# Altium schematic sheet GPRS_GNSS.SchDoc
size A3
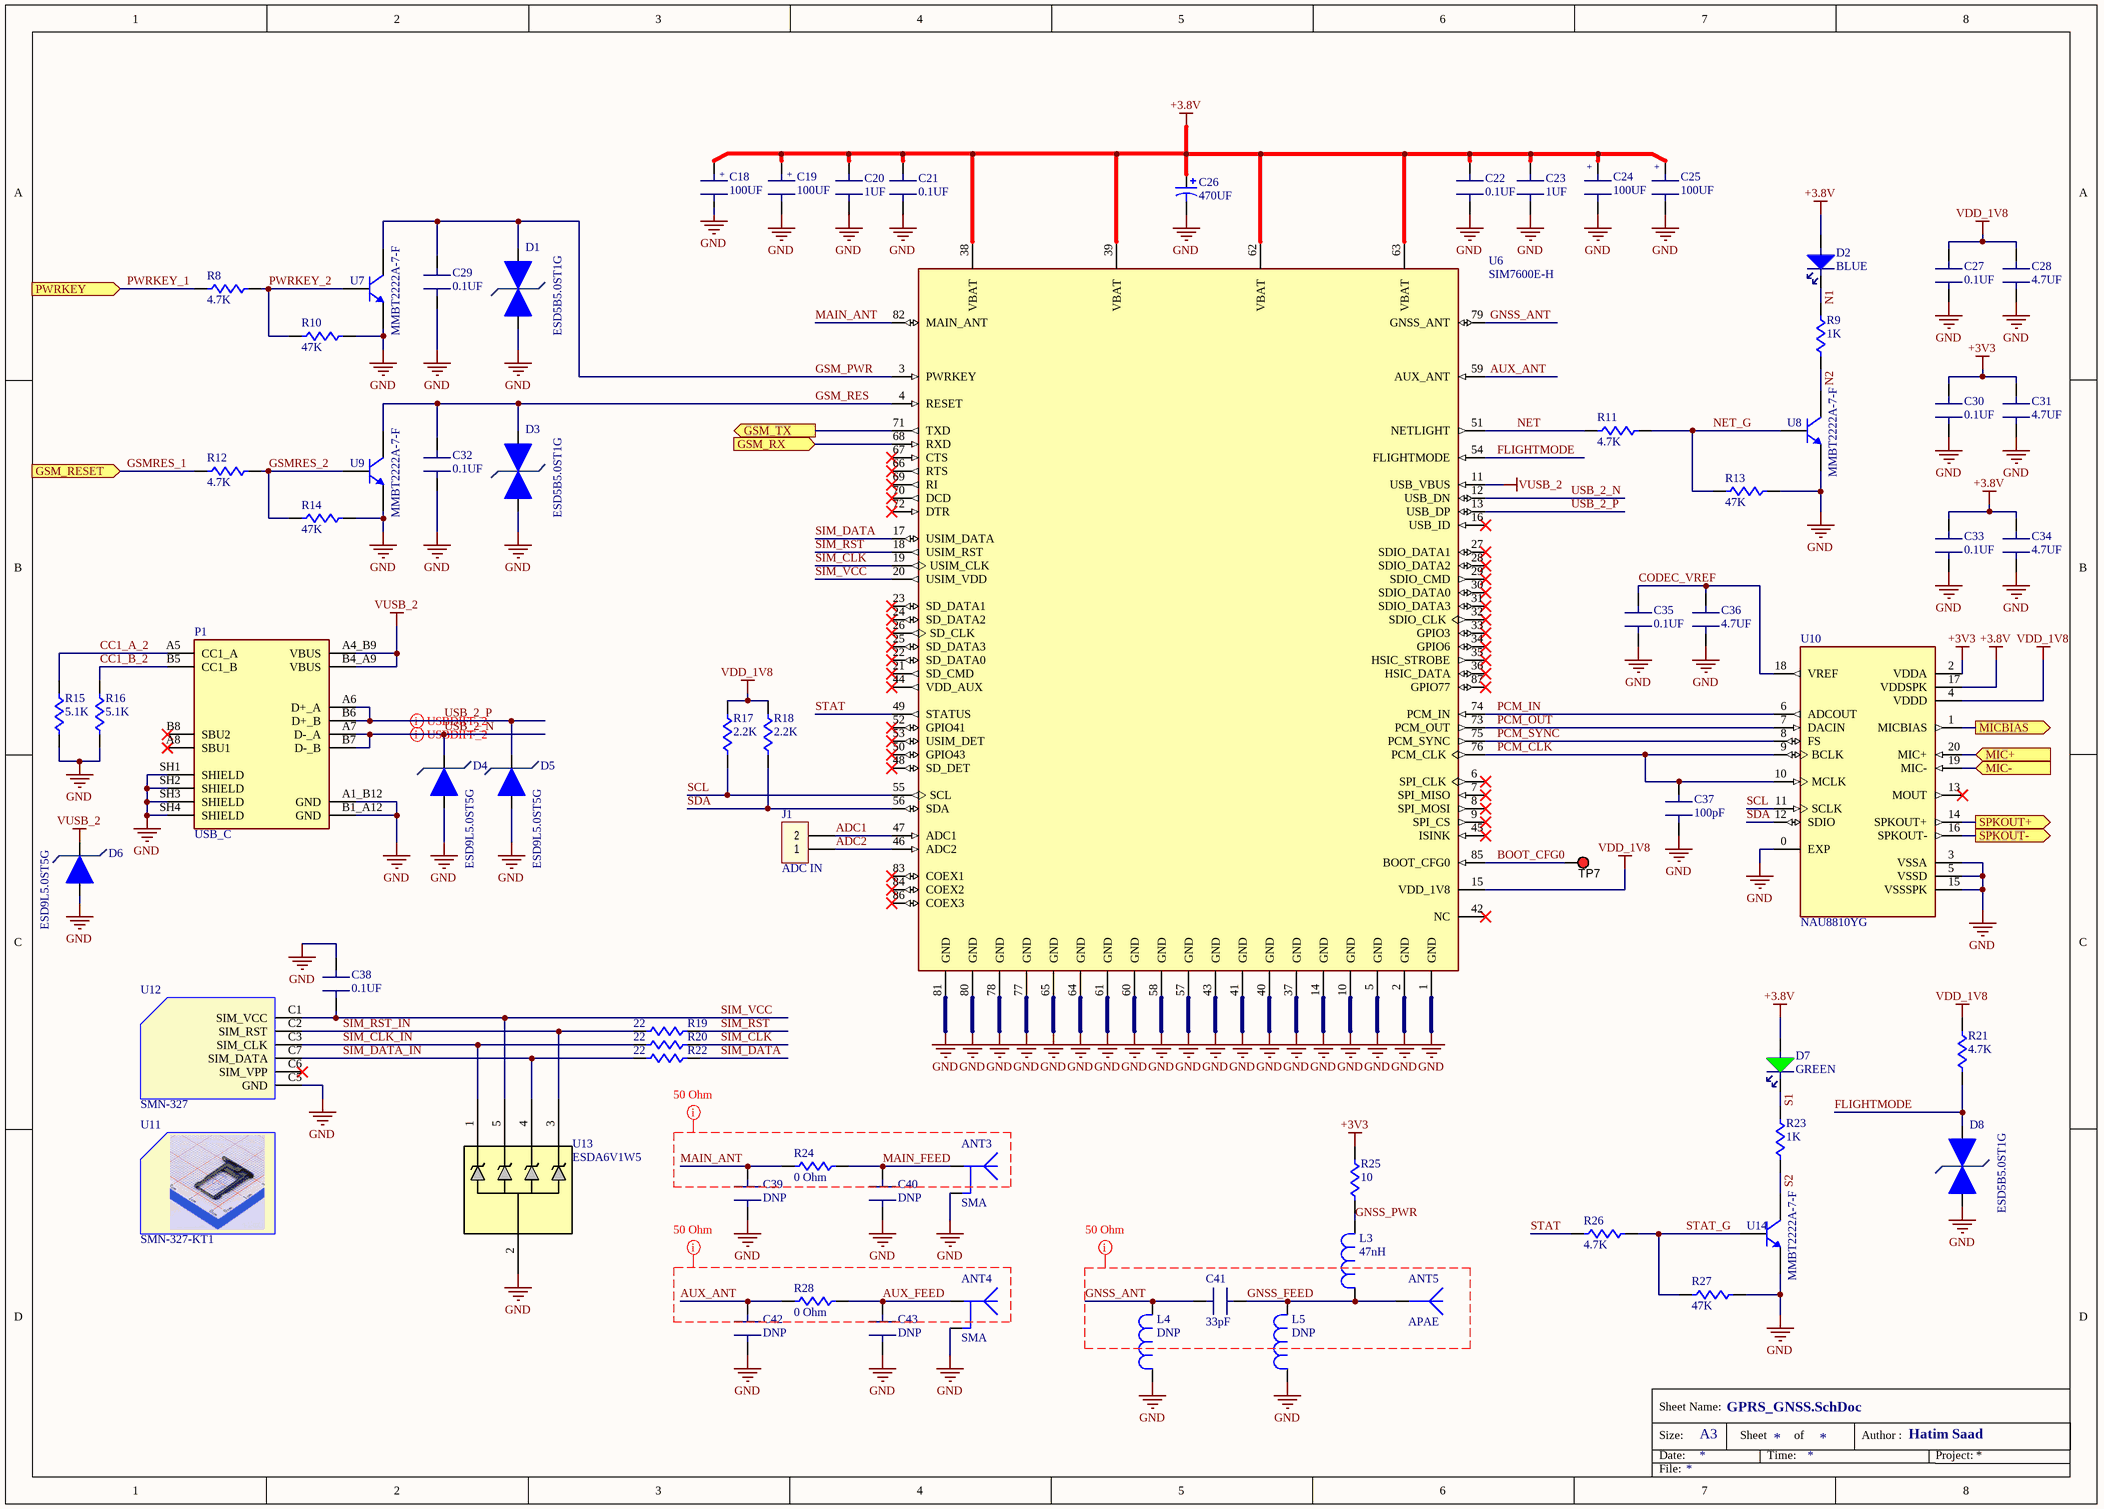
[diagram p0: GPRS_GNSS.SchDoc]

## Parts
ANT3  SMA  [SMA RIGHT DIGIKEY]
ANT4  SMA  [SMA RIGHT DIGIKEY]
ANT5  APAE  [Ceramic Patch Antenna 25x25]
C18  100UF  [CAP: TANTAL-D]
C19  100UF  [CAP: TANTAL-D]
C20  1UF  [CAP: 0603]
C21  0.1UF  [CAP: 0603]
C22  0.1UF  [CAP: 0603]
C23  1UF  [CAP: 0603]
C24  100UF  [CAP: TANTAL-D]
C25  100UF  [CAP: TANTAL-D]
C26  470UF  [CAP POLY: 7.3X4.3X2.8]
C27  0.1UF  [CAP: 0603]
C28  4.7UF  [CAP: 0805]
C29  0.1UF  [CAP: 0603]
C30  0.1UF  [CAP: 0603]
C31  4.7UF  [CAP: 0805]
C32  0.1UF  [CAP: 0603]
C33  0.1UF  [CAP: 0603]
C34  4.7UF  [CAP: 0805]
C35  0.1UF  [CAP: 0603]
C36  4.7UF  [CAP: 0805]
C37  100pF  [CAP: 0603]
C38  0.1UF  [CAP: 0603]
C39  DNP  [CAP: 0603]
C40  DNP  [CAP: 0603]
C41  33pF  [CAP: 0603]
C42  DNP  [CAP: 0603]
C43  DNP  [CAP: 0603]
D1  ESD5B5.0ST1G  [SOD-523-2]
D2  BLUE  [LED: 0603B]
D3  ESD5B5.0ST1G  [SOD-523-2]
D4  ESD9L5.0ST5G  [SOD-923-2]
D5  ESD9L5.0ST5G  [SOD-923-2]
D6  ESD9L5.0ST5G  [SOD-923-2]
D7  GREEN  [LED: 0603G]
D8  ESD5B5.0ST1G  [SOD-523-2]
J1  ADC IN  [CON: PLS-2]
L3  47nH  [IND: 0603]
L4  DNP  [IND: 0603]
L5  DNP  [IND: 0603]
P1  USB_C  [AMPHENOL_12402012E212A]
R8  4.7K  [RES: 0603]
R9  1K  [RES: 0603]
R10  47K  [RES: 0603]
R11  4.7K  [RES: 0603]
R12  4.7K  [RES: 0603]
R13  47K  [RES: 0603]
R14  47K  [RES: 0603]
R15  5.1K  [RES: 0603]
R16  5.1K  [RES: 0603]
R17  2.2K  [RES: 0603]
R18  2.2K  [RES: 0603]
R19  22  [RES: 0603]
R20  22  [RES: 0603]
R21  4.7K  [RES: 0603]
R22  22  [RES: 0603]
R23  1K  [RES: 0603]
R24  0 Ohm  [RES: 0603]
R25  10  [RES: 0603]
R26  4.7K  [RES: 0603]
R27  47K  [RES: 0603]
R28  0 Ohm  [RES: 0603]
TP7  5010  [test point]  (value not drawn)  (no BOM)
U6  SIM7600E-H  [SIM7600X]
U7  MMBT2222A-7-F  [SOT23_3]
U8  MMBT2222A-7-F  [SOT23_3]
U9  MMBT2222A-7-F  [SOT23_3]
U10  NAU8810YG  [20-QFN (4x4)]
U11  SMN-327-KT1  (mechanical)
U12  SMN-327  [SIM_NANO_SMN-327]
U13  ESDA6V1W5  [SOT323-5L]
U14  MMBT2222A-7-F  [SOT23_3]

## Ports
GSM_RESET (in), GSM_RX (in), GSM_TX (out), MIC+ (in), MIC- (in), MICBIAS (out), PWRKEY (in), SPKOUT+ (out), SPKOUT- (out)

## Nets
+3.8V: C18.1(+) C19.1(+) C20.1(A) C21.1(A) C22.1(A) C23.1(A) C24.1(+) C25.1(+) C26.1 C33.1(A) C34.2(B) D2.2(A) D7.2(A) U6.38(VBAT) U6.39(VBAT) U6.62(VBAT) U6.63(VBAT) U10.17(VDDSPK)
+3V3: C30.1(A) C31.2(B) R25.2 U10.2(VDDA)
GND: ANT3.2 ANT4.2 C18.2(-) C19.2(-) C20.2(B) C21.2(B) C22.2(B) C23.2(B) C24.2(-) C25.2(-) C26.2 C27.2(B) C28.1(A) C29.2(B) C30.2(B) C31.1(A) C32.2(B) C33.2(B) C34.1(A) C35.2(B) C36.1(A) C37.2(B) C38.1(A) C39.2(B) C40.2(B) C42.2(B) C43.2(B) D1.2 D3.2 D4.2 D5.2 D6.2 D8.2 L4.1 L5.1 P1.A1_B12(GND) P1.B1_A12(GND) P1.SH1(SHIELD) P1.SH2(SHIELD) P1.SH3(SHIELD) P1.SH4(SHIELD) R10.2 R13.2 R14.2 R15.1 R16.1 R27.2 U6.1(GND) U6.2(GND) U6.5(GND) U6.10(GND) U6.14(GND) U6.37(GND) U6.40(GND) U6.41(GND) U6.43(GND) U6.57(GND) U6.58(GND) U6.60(GND) U6.61(GND) U6.64(GND) U6.65(GND) U6.77(GND) U6.78(GND) U6.80(GND) U6.81(GND) U7.2(E) U8.2(E) U9.2(E) U10.0(EXP) U10.3(VSSA) U10.5(VSSD) U10.15(VSSSPK) U12.C5(GND) U13.2 U14.2(E)
VDD_1V8: C27.1(A) C28.2(B) R17.2 R18.2 R21.2 U6.15(VDD_1V8) U10.4(VDDD)
VUSB_2: D6.1 P1.A4_B9(VBUS) P1.B4_A9(VBUS) U6.11(USB_VBUS)
ADC1: J1.2 U6.47(ADC1)
ADC2: J1.1 U6.46(ADC2)
AUX_ANT: C42.1(A) R28.1 U6.59(AUX_ANT)
AUX_FEED: ANT4.1 C43.1(A) R28.2
BOOT_CFG0: TP7.1 U6.85(BOOT_CFG0)
CC1_A_2: P1.A5(CC1_A) R15.2
CC1_B_2: P1.B5(CC1_B) R16.2
CODEC_VREF: C35.1(A) C36.2(B) U10.18(VREF)
FLIGHTMODE: D8.1 R21.1 U6.54(FLIGHTMODE)
GNSS_ANT: C41.1(A) L4.2 U6.79(GNSS_ANT)
GNSS_FEED: ANT5.1 C41.2(B) L3.1 L5.2
GNSS_PWR: L3.2 R25.1
GSM_PWR: C29.1(A) D1.1 U6.3(PWRKEY) U7.3(C)
GSM_RES: C32.1(A) D3.1 U6.4(RESET) U9.3(C)
GSM_RX: U6.68(RXD) ; port GSM_RX
GSM_TX: U6.71(TXD) ; port GSM_TX
GSMRES_1: R12.1 ; port GSM_RESET
GSMRES_2: R12.2 R14.1 U9.1(B)
MAIN_ANT: C39.1(A) R24.1 U6.82(MAIN_ANT)
MAIN_FEED: ANT3.1 C40.1(A) R24.2
MIC+: U10.20(MIC+) ; port MIC+
MIC-: U10.19(MIC-) ; port MIC-
MICBIAS: U10.1(MICBIAS) ; port MICBIAS
N1: D2.1(C) R9.2
N2: R9.1 U8.3(C)
NET: R11.1 U6.51(NETLIGHT)
NET_G: R11.2 R13.1 U8.1(B)
PCM_CLK: C37.1(A) U6.76(PCM_CLK) U10.9(BCLK) U10.10(MCLK)
PCM_IN: U6.74(PCM_IN) U10.6(ADCOUT)
PCM_OUT: U6.73(PCM_OUT) U10.7(DACIN)
PCM_SYNC: U6.75(PCM_SYNC) U10.8(FS)
PWRKEY_1: R8.1 ; port PWRKEY
PWRKEY_2: R8.2 R10.1 U7.1(B)
S1: D7.1(C) R23.2
S2: R23.1 U14.3(C)
SCL: R17.1 U6.55(SCL) U10.11(SCLK)
SDA: R18.1 U6.56(SDA) U10.12(SDIO)
SIM_CLK: R20.2 U6.19(USIM_CLK)
SIM_CLK_IN: R20.1 U12.C3(SIM_CLK) U13.1
SIM_DATA: R22.2 U6.17(USIM_DATA)
SIM_DATA_IN: R22.1 U12.C7(SIM_DATA) U13.4
SIM_RST: R19.2 U6.18(USIM_RST)
SIM_RST_IN: R19.1 U12.C2(SIM_RST) U13.3
SIM_VCC: C38.2(B) U6.20(USIM_VDD) U12.C1(SIM_VCC) U13.5
SPKOUT+: U10.14(SPKOUT+) ; port SPKOUT+
SPKOUT-: U10.16(SPKOUT-) ; port SPKOUT-
STAT: R26.1 U6.49(STATUS)
STAT_G: R26.2 R27.1 U14.1(B)
USB_2_N: D4.1 P1.A7(D-_A) P1.B7(D-_B) U6.12(USB_DN)
USB_2_P: D5.1 P1.A6(D+_A) P1.B6(D+_B) U6.13(USB_DP)

Not connected (* = marked no-connect by the designer): P1 A8(SBU1)* B8(SBU2)*; U6 6(SPI_CLK)* 7(SPI_MISO)* 8(SPI_MOSI)* 9(SPI_CS)* 16(USB_ID)* 21(SD_CMD)* 22(SD_DATA0)* 23(SD_DATA1)* 24(SD_DATA2)* 25(SD_DATA3)* 26(SD_CLK)* 27(SDIO_DATA1)* 28(SDIO_DATA2)* 29(SDIO_CMD)* 30(SDIO_DATA0)* 31(SDIO_DATA3)* 32(SDIO_CLK)* 33(GPIO3)* 34(GPIO6)* 35(HSIC_STROBE)* 36(HSIC_DATA)* 42(NC)* 44(VDD_AUX)* 45(ISINK)* 48(SD_DET)* 50(GPIO43)* 52(GPIO41)* 53(USIM_DET)* 66(RTS)* 67(CTS)* 69(RI)* 70(DCD)* 72(DTR)* 83(COEX1)* 84(COEX2)* 86(COEX3)* 87(GPIO77)*; U10 13(MOUT)*; U12 C6(SIM_VPP)*

## Layout directives
differential pair; net class USBDIFF: USB_2_N, USB_2_P
net class ANT: AUX_ANT, AUX_FEED, GNSS_ANT, GNSS_FEED, MAIN_ANT, MAIN_FEED

## Notes on the sheet
- Size:
- Date:
- Sheet Name:
- A3
- Sheet
- Time:
- of
- Author :
- Hatim Saad
- Project:
- File:

## Library data of the parts
ANT3 ANT4 = SMA_1: Right Angled Female SMA Connector
ANT5 = APAE1575R2520ABDD7-T: 1575.42MHZ, 25*25*2mm GPS Patch Antenna; Manufacturer: Abracon; Supplier 1: Mouser; Manufacturer Part Number: APAE1575R2520ABDD7-T; RoHS: Yes; Category: RF Antennas; Stock 1: 803; Pricing 1: 1=1.7, 10=1.23, 50=1.23, 100=1.23, 1000=0.777, 10000=0.748 (USD); ComponentLink1URL: https://datasheet.ciiva.com/6491/apae1575r2520abdd7-t-6491907.pdf?src-supplier=Digi-Key; ComponentLink1Description: https://datasheet.ciiva.com/6491/apae1575r2520abdd7-t-6491907.pdf?src-supplier=Digi-Key; ComponentLink2URL: https://datasheet.ciiva.com/12398/apae1575r2520abdd7-t-218096-12398364.pdf?src-supplier=Mouser; ComponentLink2Description: https://datasheet.ciiva.com/12398/apae1575r2520abdd7-t-218096-12398364.pdf?src-supplier=Mouser; Supplier Part Number 1: 815-1575R2520ABDD7T
C18 C19 C24 C25 = 16TQC100MYF: Tantalum Polymer Capacitor, 100 uF, 16 V, ± 20%, D2, 50 mohm, 2917 [7343-19 Metric]; Manufacturer: Panasonic; Supplier 1: Mouser; Manufacturer Part Number: 16TQC100MYF; RoHS: Yes; Category: Polymer Capacitors; Stock 1: 5797; Pricing 1: 1=2.61, 10=2.17, 50=1.93, 100=1.73, 1000=1.38, 10000=1.23 (USD); ComponentLink1URL: https://datasheet.ciiva.com/48674/aaa8000ce14-48674997.pdf?src-supplier=Avnet; ComponentLink1Description: https://datasheet.ciiva.com/48674/aaa8000ce14-48674997.pdf?src-supplier=Avnet; ComponentLink2URL: https://datasheet.ciiva.com/25784/1734368-25784893.pdf?src-supplier=Farnell; ComponentLink2Description: https://datasheet.ciiva.com/25784/1734368-25784893.pdf?src-supplier=Farnell; ComponentLink3URL: https://datasheet.ciiva.com/22745/1734368-22745198.pdf?src-supplier=Element14; ComponentLink3Description: https://datasheet.ciiva.com/22745/1734368-22745198.pdf?src-supplier=Element14; Supplier Part Number 1: 667-16TQC100MYF
C20-C23 C27 C29 C30 C32 C33 C35 C37-C43 = CAP 0603: CAP SMD 0603
C26 = MPD471M0JD28009R: 4V 470uF ±20% SMD,4.3x7.3mm Solid Capacitors ROHS; ComponentLink1Description: LCSC; ComponentLink1URL: https://www.lcsc.com/product-detail/Solid-Capacitors_Ymin-MPD471M0JD28009R_C2997489.html
C28 C31 C34 C36 = CAP 0805: CAP SMD 0805
D1 D3 D8 = ESD5B5.0ST1G: ESD5B5.0S Series 5.8 V 50 W 32 pF SMT ESD Protection Diode - SOD-523; Manufacturer: ON Semiconductor; Supplier 1: Mouser; Manufacturer Part Number: ESD5B5.0ST1G; RoHS: Yes; Category: ESD and Circuit Protection ICs; Stock 1: 309834; Pricing 1: 1=0.27, 10=0.185, 50=0.185, 100=0.086, 1000=0.063, 10000=0.038 (USD); ComponentLink1URL: https://datasheet.ciiva.com/339/esd5b5-0st1g-339772.pdf?src-supplier=Digi-Key; ComponentLink1Description: https://datasheet.ciiva.com/339/esd5b5-0st1g-339772.pdf?src-supplier=Digi-Key; ComponentLink2URL: https://datasheet.ciiva.com/339/esd5b5-0st1g-339772.pdf?src-supplier=Avnet; ComponentLink2Description: https://datasheet.ciiva.com/339/esd5b5-0st1g-339772.pdf?src-supplier=Avnet; ComponentLink3URL: https://datasheet.ciiva.com/4510/esd5b5-0st1g-241623-4510548.pdf?src-supplier=Mouser; ComponentLink3Description: https://datasheet.ciiva.com/4510/esd5b5-0st1g-241623-4510548.pdf?src-supplier=Mouser; ComponentLink4URL: https://datasheet.ciiva.com/22637/716649-22637178.pdf?src-supplier=Element14; ComponentLink4Description: https://datasheet.ciiva.com/22637/716649-22637178.pdf?src-supplier=Element14; ComponentLink5URL: https://datasheet.ciiva.com/339/esd5b5-0st1-d-339773.pdf?src-supplier=Digi-Key; ComponentLink5Description: https://datasheet.ciiva.com/339/esd5b5-0st1-d-339773.pdf?src-supplier=Digi-Key; ComponentLink6URL: https://datasheet.ciiva.com/339/esd5b5-0st1-d-339774.pdf?src-supplier=Digi-Key; ComponentLink6Description: https://datasheet.ciiva.com/339/esd5b5-0st1-d-339774.pdf?src-supplier=Digi-Key; Supplier Part Number 1: 863-ESD5B50ST1G
D2 = LED BLUE 0603: LED BLUE CLEAR 0603 SMD
D4-D6 = ESD9L5.0ST5G: ESD Suppressor Diode TVS Uni-Dir 5V 9.8Vc 2-Pin SOD-923 T/R; Manufacturer: ON Semiconductor; Supplier 1: Mouser; Manufacturer Part Number: ESD9L5.0ST5G; RoHS: Yes; Category: ESD and Circuit Protection ICs; Pricing 1: 1=0.34, 10=0.245, 50=0.245, 100=0.097, 1000=0.066, 10000=0.05 (USD); ComponentLink1URL: https://datasheet.ciiva.com/15143/getdatasheetpartid-185186-15143896.pdf?src-supplier=Verical; ComponentLink1Description: https://datasheet.ciiva.com/15143/getdatasheetpartid-185186-15143896.pdf?src-supplier=Verical; ComponentLink2URL: https://datasheet.ciiva.com/339/esd9l-d-339853.pdf?src-supplier=Digi-Key; ComponentLink2Description: https://datasheet.ciiva.com/339/esd9l-d-339853.pdf?src-supplier=Digi-Key; ComponentLink3URL: https://datasheet.ciiva.com/339/esd9l-d-339854.pdf?src-supplier=Digi-Key; ComponentLink3Description: https://datasheet.ciiva.com/339/esd9l-d-339854.pdf?src-supplier=Digi-Key; ComponentLink4URL: https://datasheet.ciiva.com/339/esd9l-d-339855.pdf?src-supplier=Digi-Key; ComponentLink4Description: https://datasheet.ciiva.com/339/esd9l-d-339855.pdf?src-supplier=Digi-Key; ComponentLink5URL: https://datasheet.ciiva.com/3304/esd9l-d-3304011.pdf?src-supplier=Avnet; ComponentLink5Description: https://datasheet.ciiva.com/3304/esd9l-d-3304011.pdf?src-supplier=Avnet; ComponentLink6URL: https://datasheet.ciiva.com/11195/esd9l-d-11195342.pdf?src-supplier=Avnet; ComponentLink6Description: https://datasheet.ciiva.com/11195/esd9l-d-11195342.pdf?src-supplier=Avnet; ComponentLink7URL: https://datasheet.ciiva.com/16437/esd9l-d-16437835.pdf?src-supplier=Future+Electronics; ComponentLink7Description: https://datasheet.ciiva.com/16437/esd9l-d-16437835.pdf?src-supplier=Future+Electronics; Supplier Part Number 1: 863-ESD9L5.0ST5G
D7 = LED GREEN 0603: LED GREEN CLEAR 0603 SMD
J1 = CONN 2_HF
L3-L5 = IND 0603: IND SMD 0603
P1 = 12402012E212A: USB Connectors USB2.0, Type C, Top mount, CH 1.68mm, Dual Row SMT; Manufacturer: Amphenol; Supplier: Mouser; Supplier Part Number: 523-12402012E212A; Manufacturer Part Number: 12402012E212A; RoHS: No; Category: Connectors; Stock: 14661; Pricing: 1=0.66, 10=0.523, 50=0.502, 100=0.46, 1000=0.345, 10000=0.293 (USD); Supplier 1: Mouser; Supplier Part Number 1: 523-12402012E212A
R8-R28 = RES 0603: RES SMD 0603
TP7 = test point: Test Point, Multipurpose, Red, TH; Manufacturer: Keystone; CompType: Test Point Loop; U/M: EA; PartNumber: 5010; SymbolVersion: 2008-04-04; PackageReference: Red Multipurpose Testpoint; RoHS: Y; MountType: TH; ComponentLink1Description: Datasheet Link; ComponentLink1URL: http://www.keyelco.com/userAssets/file/M60-2p60.pdf; Value: Red; Publisher: Texas Instruments; LatestRevisionDate: 2015-08-25
U6 = SIM7600E-H: RF TXRX MODULE CELLULAR LTE SMD
U7-U9 U14 = MMBT2222A-7-F: MMBT2222 Series NPN 350 mW 40 V 600 mA SMT Small Signal Transistor - SOT-23; Manufacturer: Diodes; hFE Min: 100; Frequency: 300MHz; Max Power Dissipation: 300mW; Number of Elements: 1; Collector Emitter Voltage (VCEO): 40V; Collector Base Voltage (VCBO): 75V; Emitter Base Voltage (VEBO): 6V; Collector Emitter Saturation Voltage: 1V; Max Collector Current: 600mA; Power Dissipation: 350mW; Current: 1A; Supplier 1: Mouser; Manufacturer Part Number: MMBT2222A-7-F; RoHS: Yes; Category: BJTs; Stock 1: 1332144; Pricing 1: 1=0.14, 10=0.097, 50=0.097, 100=0.041, 1000=0.028, 10000=0.016 (USD); Mount: Surface Mount; Case/Package: SOT-23; Number of Pins: 3; Weight: 0.000282oz; Min Operating Temperature: -55°C; Max Operating Temperature: 150°C; Polarity: NPN; Packaging: Tape and Reel; Package Quantity: 3000; Continuous Collector Current: 600mA; Collector Emitter Breakdown Voltage: 40V; Transition Frequency: 300MHz; Max Breakdown Voltage: 40V; Max Frequency: 300MHz; Termination: SMD/SMT; Gain Bandwidth Product: 300MHz; Voltage Rating (DC): 40V; Current Rating: 600mA; Voltage: 40V; Collector-emitter Voltage-Max: 1V; Series: Automotive, AEC-Q101; Length: 3.05mm; Width: 1.4mm; Height: 1mm; Radiation Hardening: No; Reach SVHC Compliant: No; Lead Free: Lead Free; RoHS Compliant: Yes; ComponentLink1URL: https://datasheet.ciiva.com/15139/getdatasheetpartid-82692-15139078.pdf?src-supplier=Verical; ComponentLink1Description: https://datasheet.ciiva.com/15139/getdatasheetpartid-82692-15139078.pdf?src-supplier=Verical; ComponentLink2URL: https://datasheet.ciiva.com/8029/ds30041-8029709.pdf?src-supplier=Element14; ComponentLink2Description: https://datasheet.ciiva.com/8029/ds30041-8029709.pdf?src-supplier=Element14; ComponentLink3URL: https://datasheet.ciiva.com/11201/ds30041-11201864.pdf?src-supplier=Avnet; ComponentLink3Description: https://datasheet.ciiva.com/11201/ds30041-11201864.pdf?src-supplier=Avnet; ComponentLink4URL: https://datasheet.ciiva.com/16199/ds30041-16199045.pdf?src-supplier=Future+Electronics; ComponentLink4Description: https://datasheet.ciiva.com/16199/ds30041-16199045.pdf?src-supplier=Future+Electronics; ComponentLink5URL: https://datasheet.ciiva.com/11198/ds30041-11198965.pdf?src-supplier=Avnet; ComponentLink5Description: https://datasheet.ciiva.com/11198/ds30041-11198965.pdf?src-supplier=Avnet; ComponentLink6URL: https://datasheet.ciiva.com/972/ds30041-972551.pdf?src-supplier=Digi-Key; ComponentLink6Description: https://datasheet.ciiva.com/972/ds30041-972551.pdf?src-supplier=Digi-Key; ComponentLink7URL: https://datasheet.ciiva.com/972/ds30041-972552.pdf?src-supplier=Digi-Key; ComponentLink7Description: https://datasheet.ciiva.com/972/ds30041-972552.pdf?src-supplier=Digi-Key; ComponentLink8URL: https://datasheet.ciiva.com/972/ds30041-972550.pdf?src-supplier=Digi-Key; ComponentLink8Description: https://datasheet.ciiva.com/972/ds30041-972550.pdf?src-supplier=Digi-Key; Supplier Part Number 1: 621-MMBT2222A-F
U10 = NAU8810YG: IC Audio Codec Mono 20QFN; Manufacturer: Nuvoton; Resolution: 24b; Supplier: Digi-Key; Supplier Part Number: NAU8810YG-ND; Manufacturer Part Number: NAU8810YG; RoHS: No; Category: Integrated Circuits (ICs); Stock: 27148; Pricing: 1=2.56, 10=2.302, 25=2.1716, 80=1.85013, 230=1.73722, 490=1.52004, 980=1.25947, 2450=1.17261, 4900=1.12918 (USD); Mounting Technology: Surface Mount; Case/Package: QFN; Min Operating Temperature: -40°C; Max Operating Temperature: 85°C; Packaging: Tray; Series: emPowerAudio™; ComponentLink1URL: https://datasheet.ciiva.com/18624/nau8810-datasheet-rev-1-2-18624999.pdf?src-supplier=Digi-Key; ComponentLink1Description: https://datasheet.ciiva.com/18624/nau8810-datasheet-rev-1-2-18624999.pdf?src-supplier=Digi-Key; Supplier 1: Digi-Key; Supplier Part Number 1: NAU8810YG-ND
U11 = C390998: NanoSIM tray SIM Card Connectors; Publisher: Bastam Beyrami; ComponentLink1Description: LCSC; ComponentLink1URL: https://lcsc.com/product-detail/SIM-Card-Connectors_XUNPU-SMN-327-KT1_C390998.html
U12 = C390997: NanoSIM SMD SIM Card Connectors; Publisher: Bastam Beyrami; ComponentLink1Description: LCSC; ComponentLink1URL: https://lcsc.com/product-detail/SIM-Card-Connectors_XUNPU-SMN-327_C390997.html
U13 = ESDA6V1W5: ESDA Series 4 Channel 6.1V 90 pF SMT Uni-Directional Transil Array - SOT-323-5L; Manufacturer: STMicroelectronics; Direction: Unidirectional; Number of Elements: 4; Value: 90pF; Operating Supply Voltage: 3V; Breakdown Voltage: 7.2V; Peak Pulse Power: 150W; Power Line Protection: No; Leakage Current: 1uA; Test Current: 1mA; ESD Protection: Yes; Peak Pulse Current: 15A; Diode Type: ZENER; Supplier: Mouser; Supplier Part Number: 511-ESDA6V1W5; Manufacturer Part Number: ESDA6V1W5; RoHS: Yes; Category: TVS Diodes; Stock: 3674; Pricing: 1=0.43, 10=0.362, 50=0.362, 100=0.285, 1000=0.178, 10000=0.125 (USD); Mounting Technology: Surface Mount; Case/Package: SOT-323; Pins: 5; Min Operating Temperature: -40°C; Max Operating Temperature: 125°C; Packaging: Tape and Reel; Reverse Breakdown Voltage: 6.1V; Package Quantity: 1; Polarity: Unidirectional; Number of Channels: 4; Termination: SMD/SMT; Number of Unidirectional Channels: 4; Reverse Standoff Voltage: 3V; Min Breakdown Voltage: 6.1V; Working Voltage: 3V; Max Reverse Leakage Current: 1uA; Max Breakdown Voltage: 7.2V; Voltage Rating (DC): 6.1V; Series: ESDA, TRANSIL™; Length: 2.2mm; Width: 1.35mm; Height: 1mm; Depth: 1.35mm; Radiation Hardening: No; Reach SVHC Compliant: No; Lead Free: Lead Free; RoHS Compliant: Yes; ComponentLink1URL: https://datasheet.ciiva.com/15143/getdatasheetpartid-134557-15143650.pdf?src-supplier=Verical; ComponentLink1Description: https://datasheet.ciiva.com/15143/getdatasheetpartid-134557-15143650.pdf?src-supplier=Verical; ComponentLink2URL: https://datasheet.ciiva.com/1276/1671027-1276908.pdf?src-supplier=Element14; ComponentLink2Description: https://datasheet.ciiva.com/1276/1671027-1276908.pdf?src-supplier=Element14; ComponentLink3URL: https://datasheet.ciiva.com/22695/1671027-22695673.pdf?src-supplier=Element14; ComponentLink3Description: https://datasheet.ciiva.com/22695/1671027-22695673.pdf?src-supplier=Element14; ComponentLink4URL: https://datasheet.ciiva.com/338/cd00064033-338380.pdf?src-supplier=Digi-Key; ComponentLink4Description: https://datasheet.ciiva.com/338/cd00064033-338380.pdf?src-supplier=Digi-Key; ComponentLink5URL: https://datasheet.ciiva.com/338/cd00064033-338379.pdf?src-supplier=Digi-Key; ComponentLink5Description: https://datasheet.ciiva.com/338/cd00064033-338379.pdf?src-supplier=Digi-Key; ComponentLink6URL: https://datasheet.ciiva.com/338/cd00064033-338381.pdf?src-supplier=Digi-Key; ComponentLink6Description: https://datasheet.ciiva.com/338/cd00064033-338381.pdf?src-supplier=Digi-Key; ComponentLink7URL: https://datasheet.ciiva.com/41443/001184222-da-01-en-transil-array-da-esda6v1w5-sot-323-5-stm-41443642.pdf?src-supplier=Conrad; ComponentLink7Description: https://datasheet.ciiva.com/41443/001184222-da-01-en-transil-array-da-esda6v1w5-sot-323-5-stm-41443642.pdf?src-supplier=Conrad; Supplier 1: Mouser; Supplier Part Number 1: 511-ESDA6V1W5